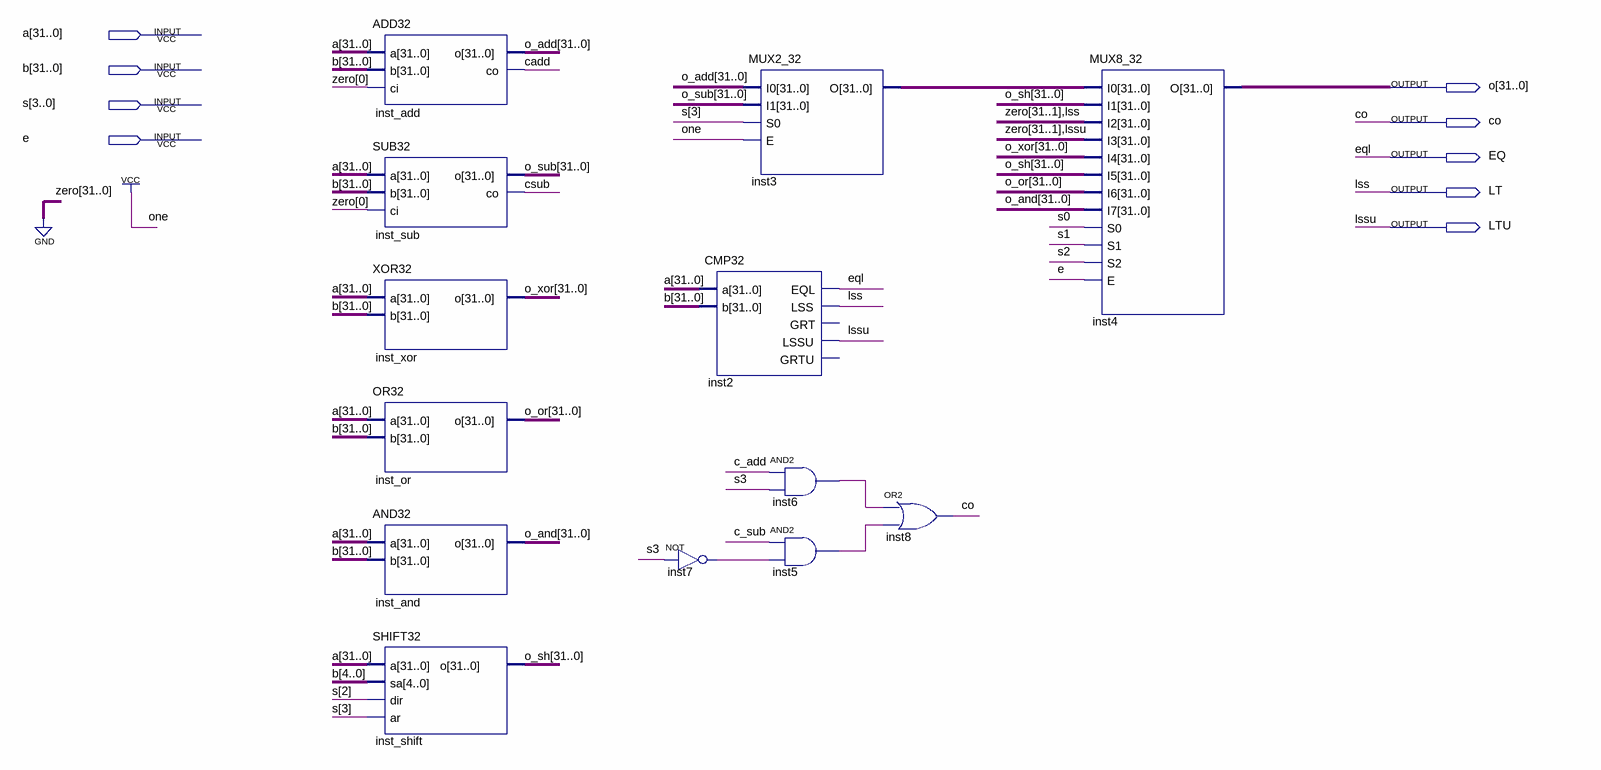
[diagram p0: schematic sheet]
// Quartus schematic ALU.bdf as structural Verilog: 13 symbols, 9 pins
module ALU (
  input  [31:0] a,
  input  [31:0] b,
  input  [3:0] s,
  input  e,
  output [31:0] o,
  output co,
  output EQ,
  output LT,
  output LTU
);

  wire c_add, c_sub, cadd, csub, inst5_out, inst6_out, inst7_out;
  wire [31:0] inst3_o, o_add, o_and, o_or, o_sh, o_sub, o_xor;

  ADD32 inst_add (.a(a), .b(b), .ci(1'b0), .o(o_add), .co(cadd));
  SUB32 inst_sub (.a(a), .b(b), .ci(1'b0), .o(o_sub), .co(csub));
  XOR32 inst_xor (.a(a), .b(b), .o(o_xor));
  OR32 inst_or (.a(a), .b(b), .o(o_or));
  AND32 inst_and (.a(a), .b(b), .o(o_and));
  SHIFT32 inst_shift (.a(a), .sa(b[4:0]), .dir(s[2]), .ar(s[3]), .o(o_sh));
  not inst7 (inst7_out, s[3]);
  CMP32 inst2 (.a(a), .b(b), .EQL(EQ), .LSS(LT), .LSSU(LTU));  // open: GRT, GRTU
  MUX2_32 inst3 (.I0(o_add), .I1(o_sub), .S0(s[3]), .E(1'b1), .O(inst3_o));
  and inst6 (inst6_out, c_add, s[3]);
  and inst5 (inst5_out, c_sub, inst7_out);
  or inst8 (co, inst6_out, inst5_out);
  MUX8_32 inst4 (
    .I0(inst3_o), .I1(o_sh), .I2({{31{1'b0}}, LT}), .I3({{31{1'b0}}, LTU}), .I4(o_xor), .I5(o_sh), .I6(o_or),
    .I7(o_and), .S0(s[0]), .S1(s[1]), .S2(s[2]), .E(e), .O(o));

  // Other names for the same wires on the sheet: eql = EQ; lss = LT; lssu = LTU
endmodule
